# Altium schematic sheet VoltageLEDs.SchDoc
size A4; Organization: Altium Limited; Address1: L3, 12a Rodborough Rd; Address2: Frenchs Forest; Address3: NSW; Address4: Australia 2086
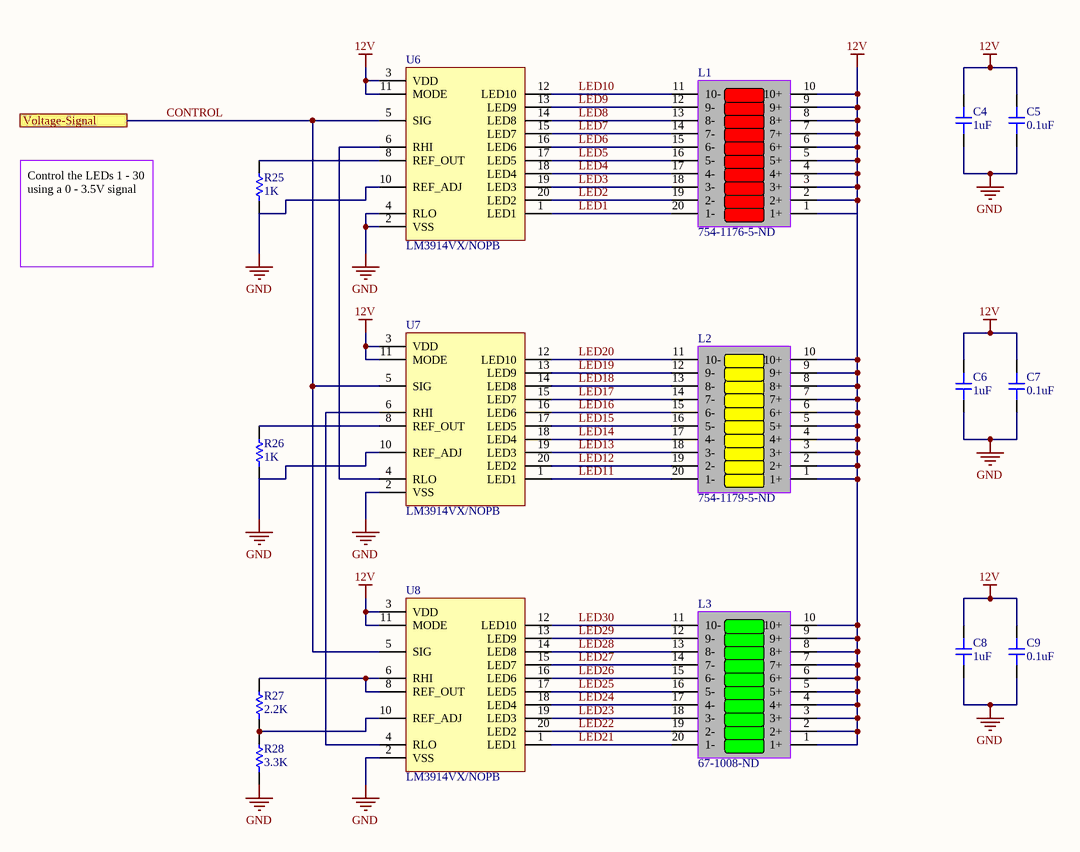
[diagram p0: VoltageLEDs.SchDoc]

## Parts
C4  1uF  [CAP-0805]
C5  0.1uF  [CAP-0805]
C6  1uF  [CAP-0805]
C7  0.1uF  [CAP-0805]
C8  1uF  [CAP-0805]
C9  0.1uF  [CAP-0805]
L1  754-1176-5-ND  [LEDBAR-10]
L2  754-1179-5-ND  [LEDBAR-10]
L3  67-1008-ND  [LEDBAR-10]
R25  1K  [RES-0603]
R26  1K  [RES-0603]
R27  2.2K  [RES-0603]
R28  3.3K  [RES-0603]
U6  LM3914VX/NOPB  [PLCC127P990X990X457-20N]
U7  LM3914VX/NOPB  [PLCC127P990X990X457-20N]
U8  LM3914VX/NOPB  [PLCC127P990X990X457-20N]

## Ports
Voltage-Signal

## Nets
12V: C4.2 C5.2 C6.2 C7.2 C8.2 C9.2 L1.1(1+) L1.2(2+) L1.3(3+) L1.4(4+) L1.5(5+) L1.6(6+) L1.7(7+) L1.8(8+) L1.9(9+) L1.10(10+) L2.1(1+) L2.2(2+) L2.3(3+) L2.4(4+) L2.5(5+) L2.6(6+) L2.7(7+) L2.8(8+) L2.9(9+) L2.10(10+) L3.1(1+) L3.2(2+) L3.3(3+) L3.4(4+) L3.5(5+) L3.6(6+) L3.7(7+) L3.8(8+) L3.9(9+) L3.10(10+) U6.3(VDD) U6.11(MODE) U7.3(VDD) U7.11(MODE) U8.3(VDD) U8.11(MODE)
GND: C4.1 C5.1 C6.1 C7.1 C8.1 C9.1 R25.1 R26.1 R28.1 U6.2(VSS) U6.4(RLO) U6.10(REF_ADJ) U7.2(VSS) U7.10(REF_ADJ) U8.2(VSS)
CONTROL: U6.5(SIG) U7.5(SIG) U8.5(SIG) ; port Voltage-Signal
LED1: L1.20(1-) U6.1(LED1)
LED2: L1.19(2-) U6.20(LED2)
LED3: L1.18(3-) U6.19(LED3)
LED4: L1.17(4-) U6.18(LED4)
LED5: L1.16(5-) U6.17(LED5)
LED6: L1.15(6-) U6.16(LED6)
LED7: L1.14(7-) U6.15(LED7)
LED8: L1.13(8-) U6.14(LED8)
LED9: L1.12(9-) U6.13(LED9)
LED10: L1.11(10-) U6.12(LED10)
LED11: L2.20(1-) U7.1(LED1)
LED12: L2.19(2-) U7.20(LED2)
LED13: L2.18(3-) U7.19(LED3)
LED14: L2.17(4-) U7.18(LED4)
LED15: L2.16(5-) U7.17(LED5)
LED16: L2.15(6-) U7.16(LED6)
LED17: L2.14(7-) U7.15(LED7)
LED18: L2.13(8-) U7.14(LED8)
LED19: L2.12(9-) U7.13(LED9)
LED20: L2.11(10-) U7.12(LED10)
LED21: L3.20(1-) U8.1(LED1)
LED22: L3.19(2-) U8.20(LED2)
LED23: L3.18(3-) U8.19(LED3)
LED24: L3.17(4-) U8.18(LED4)
LED25: L3.16(5-) U8.17(LED5)
LED26: L3.15(6-) U8.16(LED6)
LED27: L3.14(7-) U8.15(LED7)
LED28: L3.13(8-) U8.14(LED8)
LED29: L3.12(9-) U8.13(LED9)
LED30: L3.11(10-) U8.12(LED10)
NetR25_2: R25.2 U6.8(REF_OUT)
NetR26_2: R26.2 U7.8(REF_OUT)
NetR27_1: R27.1 R28.2 U8.10(REF_ADJ)
NetR27_2: R27.2 U8.6(RHI) U8.8(REF_OUT)
NetU6_6: U6.6(RHI) U7.4(RLO)
NetU7_6: U7.6(RHI) U8.4(RLO)

## Notes on the sheet
- Control the LEDs 1 - 30 using a 0 - 3.5V signal
- Title
- Size:
- Date:
- A4
- Number:
- Time:
- Revision:
- Sheet
- of
- File:

## Library data of the parts
C4 C6 C8 = C0805C105K5PACTU: CAP CER 1UF 50V X5R 0805; Manufacturer: KEMET; Dielectric Material: Ceramic; Tolerance: 10%; Supplier 1: Digi-Key; Manufacturer Part Number: C0805C105K5PACTU; Stock 1: 7193; Pricing 1: 1=0.33, 10=0.23, 100=0.1378, 500=0.10334, 1000=0.08726 (USD); Mount: Surface Mount; Case/Package: 0805; Weight: 0.000194oz; Case Code (Metric): 2012; Case Code (Imperial): 0805; Min Operating Temperature: -55°C; Max Operating Temperature: 85°C; Voltage Rating: 50V; Dielectric: X5R; Packaging: Tape and Reel; Termination: SMD/SMT; Voltage Rating (DC): 50V; Package Quantity: 2500; Capacitance: 1uF; Length: 0.079inch; Width: 0.049inch; Thickness: 0.055inch; REACH SVHC: No SVHC; Lead Free: Lead Free; ComponentLink1URL: https://api.kemet.com/component-edge/download/datasheet/C0805C105K5PAC7800.pdf?src-supplier=Digi-Key; ComponentLink1Description: https://api.kemet.com/component-edge/download/datasheet/C0805C105K5PAC7800.pdf?src-supplier=Digi-Key; ComponentLink2URL: http://www.farnell.com/datasheets/2746140.pdf?src-supplier=Farnell; ComponentLink2Description: http://www.farnell.com/datasheets/2746140.pdf?src-supplier=Farnell; ComponentLink3URL: http://www.mouser.com/ds/2/212/KEM_C1006_X5R_SMD-1103249.pdf?src-supplier=Mouser; ComponentLink3Description: http://www.mouser.com/ds/2/212/KEM_C1006_X5R_SMD-1103249.pdf?src-supplier=Mouser; ComponentLink4URL: http://www.farnell.com/datasheets/2746140.pdf?src-supplier=Newark; ComponentLink4Description: http://www.farnell.com/datasheets/2746140.pdf?src-supplier=Newark; ComponentLink5URL: http://www.farnell.com/datasheets/2032728.pdf?src-supplier=Element14; ComponentLink5Description: http://www.farnell.com/datasheets/2032728.pdf?src-supplier=Element14; Supplier Part Number 1: 399-15436-6-ND
C5 C7 C9 = C0805C104Z5VACTU: CAP CER 0.1UF 50V Y5V 0805; Manufacturer: KEMET; Dielectric Material: Ceramic; Capacitance: 100nF; Tolerance: 80%; Dissipation Factor: 5%; Supplier 1: Digi-Key; Manufacturer Part Number: C0805C104Z5VACTU; Stock 1: 929243; Pricing 1: 1=0.1, 10=0.057, 100=0.0254, 500=0.01818, 1000=0.01428 (USD); Mount: Surface Mount,PCB; Case/Package: 0805; Number of Pins: 2; Case Code (Metric): 2012; Case Code (Imperial): 0805; Min Operating Temperature: -30°C; Max Operating Temperature: 85°C; Package Quantity: 1; Voltage Rating: 50V; Packaging: Tape and Reel; Voltage Rating (DC): 50V; Dielectric: Y5V; Termination: SMD/SMT; Voltage: 50V; Length: 2mm; Height: 0.9mm; Lead Pitch: 0.75mm; Width: 0.049inch; Thickness: 0.039inch; Depth: 1.25mm; Radiation Hardening: No; REACH SVHC: No SVHC; Lead Free: Lead Free; ComponentLink1URL: http://www.alliedelec.com/m/d/9bfe7773041ffe9d406e68bc7b377fdd.pdf?src-supplier=Allied+Electronics; ComponentLink1Description: http://www.alliedelec.com/m/d/9bfe7773041ffe9d406e68bc7b377fdd.pdf?src-supplier=Allied+Electronics; ComponentLink2URL: https://www.verical.com/server-webapp/html/getDatasheet?partID=37101&src-supplier=Verical; ComponentLink2Description: https://www.verical.com/server-webapp/html/getDatasheet?partID=37101&src-supplier=Verical; ComponentLink3URL: https://www.verical.com/server-webapp/html/getDatasheet?partID=321176&src-supplier=Verical; ComponentLink3Description: https://www.verical.com/server-webapp/html/getDatasheet?partID=321176&src-supplier=Verical; ComponentLink4URL: http://www.farnell.com/datasheets/2123124.pdf?src-supplier=Element14; ComponentLink4Description: http://www.farnell.com/datasheets/2123124.pdf?src-supplier=Element14; Supplier Part Number 1: 399-1177-6-ND
L1 = 754-1176-5-ND: LED BAR GRAPH 10SEG 627NM RED; Manufacturer: Kingbright; Manufacturer Part Number: DC-10EWA; Lens Color: White; Lens Style: Diffused; Voltage Rating: 2V; Luminous Intensity: 9mcd; Wavelength: 625nm; Current: 30mA; Number of Segments: 10; Forward Current: 20mA; Lens Size: 1.78mm; Supplier 1: Digi-Key; Stock 1: 21; Pricing 1: 1=2.79, 10=2.474, 100=1.4364, 500=1.2768, 1000=1.09725, 2500=1.0374, 5000=1.01346, 10000=0.9975, 25000=0.97356 (USD); Mount: Through Hole; Color: Red; Min Operating Temperature: -40°C; Max Operating Temperature: 85°C; Forward Voltage: 2V; Illumination Color: Red; Package Quantity: 20; Operating Supply Voltage: 2V; Packaging: Rail/Tube; Number of LEDs: 10; Display Type: Bar Graph; Length: 25.4mm; Height: 10.16mm; Width: 25.4mm; REACH SVHC: No SVHC; Lead Free: Lead Free; ComponentLink1URL: https://www.distrelec.biz/Web/Downloads/12/75/tl661272-661275.pdf?mime=application%2Fpdf&src-supplier=Distrelec; ComponentLink1Description: https://www.distrelec.biz/Web/Downloads/12/75/tl661272-661275.pdf?mime=application%2Fpdf&src-supplier=Distrelec; ComponentLink2URL: http://www.mouser.com/ds/2/216/DC10EWA-8483.pdf?src-supplier=Mouser; ComponentLink2Description: http://www.mouser.com/ds/2/216/DC10EWA-8483.pdf?src-supplier=Mouser; ComponentLink3URL: http://www.kingbrightusa.com/images/catalog/SPEC/DC10EWA.pdf?src-supplier=Digi-Key; ComponentLink3Description: http://www.kingbrightusa.com/images/catalog/SPEC/DC10EWA.pdf?src-supplier=Digi-Key; ComponentLink4URL: http://uk.rs-online.com/webdocs/1385/0900766b81385017.pdf?src-supplier=RSComponents; ComponentLink4Description: http://uk.rs-online.com/webdocs/1385/0900766b81385017.pdf?src-supplier=RSComponents; ComponentLink5URL: http://www.rapidonline.com/pdf/55-0190e.pdf?src-supplier=Rapid+Electronics; ComponentLink5Description: http://www.rapidonline.com/pdf/55-0190e.pdf?src-supplier=Rapid+Electronics; ComponentLink6URL: http://www.farnell.com/datasheets/1683489.pdf?src-supplier=Element14; ComponentLink6Description: http://www.farnell.com/datasheets/1683489.pdf?src-supplier=Element14; ComponentLink7URL: http://www.produktinfo.conrad.com/datenblaetter/175000-199999/184837-da-01-en-RGB_ROT_LED_BAND.pdf?src-supplier=Conrad; ComponentLink7Description: http://www.produktinfo.conrad.com/datenblaetter/175000-199999/184837-da-01-en-RGB_ROT_LED_BAND.pdf?src-supplier=Conrad; ComponentLink8URL: http://www.produktinfo.conrad.com/datenblaetter/150000-174999/160137-da-01-en-BARGRAPH_ANZEIGE_TYP_DC_10EWA.pdf?src-supplier=Conrad; ComponentLink8Description: http://www.produktinfo.conrad.com/datenblaetter/150000-174999/160137-da-01-en-BARGRAPH_ANZEIGE_TYP_DC_10EWA.pdf?src-supplier=Conrad; Supplier Part Number 1: 754-1176-5-ND
L2 = LEDBAR-10-YLW: LED BAR GRAPH 10SEG 590NM YLW; Manufacturer: Kingbright; Manufacturer Part Number: DC-10YWA; Color: Yellow; Lens Color: White; Lens Style: Diffused,Round,Domed; Voltage Rating: 2.1V; Luminous Intensity: 9mcd; Wavelength: 588nm; Current: 30mA; Number of Segments: 10; Forward Current: 20mA; Lens Size: 3mm; Supplier 1: Digi-Key; Stock 1: 23; Pricing 1: 1=2.84, 10=2.517, 100=1.4616, 500=1.2992, 1000=1.1165, 2500=1.0556, 5000=1.03124, 10000=1.015, 25000=0.99064 (USD); Mount: Through Hole; Number of Pins: 20; Min Operating Temperature: -40°C; Max Operating Temperature: 85°C; Package Quantity: 20; Packaging: Rail/Tube; Forward Voltage: 2.1V; Illumination Color: Yellow; Operating Supply Voltage: 2.1V; Number of LEDs: 10; Display Type: Bar Graph; Height: 10.16mm; Width: 25.4mm; REACH SVHC: No SVHC; ComponentLink1URL: http://www.rapidonline.com/pdf/55-0190e.pdf?src-supplier=Rapid+Electronics; ComponentLink1Description: http://www.rapidonline.com/pdf/55-0190e.pdf?src-supplier=Rapid+Electronics; ComponentLink2URL: https://www.distrelec.biz/Web/Downloads/12/75/tl661272-661275.pdf?mime=application%2Fpdf&src-supplier=Distrelec; ComponentLink2Description: https://www.distrelec.biz/Web/Downloads/12/75/tl661272-661275.pdf?mime=application%2Fpdf&src-supplier=Distrelec; ComponentLink3URL: http://www.kingbrightusa.com/images/catalog/SPEC/DC10YWA.pdf?src-supplier=Digi-Key; ComponentLink3Description: http://www.kingbrightusa.com/images/catalog/SPEC/DC10YWA.pdf?src-supplier=Digi-Key; ComponentLink4URL: http://uk.rs-online.com/webdocs/0026/0900766b80026db8.pdf?src-supplier=RSComponents; ComponentLink4Description: http://uk.rs-online.com/webdocs/0026/0900766b80026db8.pdf?src-supplier=RSComponents; ComponentLink5URL: http://www.farnell.com/datasheets/1683491.pdf?src-supplier=Element14; ComponentLink5Description: http://www.farnell.com/datasheets/1683491.pdf?src-supplier=Element14; ComponentLink6URL: http://www.mouser.com/ds/2/216/DC10YWA-43302.pdf?src-supplier=Mouser; ComponentLink6Description: http://www.mouser.com/ds/2/216/DC10YWA-43302.pdf?src-supplier=Mouser; ComponentLink7URL: http://www.produktinfo.conrad.com/datenblaetter/150000-174999/160142-da-01-en-BARGRAPH_ANZEIGE_TYP_DC_10YWA.pdf?src-supplier=Conrad; ComponentLink7Description: http://www.produktinfo.conrad.com/datenblaetter/150000-174999/160142-da-01-en-BARGRAPH_ANZEIGE_TYP_DC_10YWA.pdf?src-supplier=Conrad; Supplier Part Number 1: 754-1179-5-ND
L3 = LEDBAR-10-GRN: LED ARRAY 10X25MM 10SEG GRN DIFF; Manufacturer: Lumex; Manufacturer Part Number: SSA-LXB10GW-GF/LP; Color: Green; Voltage Rating: 2.2V; Operating Supply Voltage: 2.6V; Number of Contacts: 18; Display Type: Bar Graph; Luminous Intensity: 8mcd; Forward Current: 20mA; Wavelength: 565nm; Power Consumption: 105mW; Viewing Angle: 160°; Lens Style: Diffused; Current: 25mA; Number of LEDs: 10; Supplier 1: Digi-Key; Stock 1: 6048; Pricing 1: 1=2.28, 10=2.018, 100=1.1718, 500=1.0416, 1000=0.89513, 2500=0.8463, 5000=0.82677, 10000=0.81375 (USD); Mount: Through Hole; Min Operating Temperature: -40°C; Max Operating Temperature: 85°C; Package Quantity: 20; Packaging: Bulk; Forward Voltage: 2.2V; Illumination Color: Green; Length: 25.1mm; Height: 6.8mm; Width: 10.1mm; REACH SVHC: No SVHC; Lead Free: Lead Free; ComponentLink1URL: http://www.lumex.com/content/files/ProductAttachment/SSA-LXB10GW-GF-LP.pdf?src-supplier=Digi-Key; ComponentLink1Description: http://www.lumex.com/content/files/ProductAttachment/SSA-LXB10GW-GF-LP.pdf?src-supplier=Digi-Key; ComponentLink2URL: http://www.farnell.com/datasheets/677482.pdf?src-supplier=Farnell; ComponentLink2Description: http://www.farnell.com/datasheets/677482.pdf?src-supplier=Farnell; ComponentLink3URL: http://www.farnell.com/datasheets/677482.pdf?src-supplier=Element14; ComponentLink3Description: http://www.farnell.com/datasheets/677482.pdf?src-supplier=Element14; ComponentLink4URL: http://www.farnell.com/datasheets/269031.pdf?src-supplier=Element14; ComponentLink4Description: http://www.farnell.com/datasheets/269031.pdf?src-supplier=Element14; ComponentLink5URL: http://www.mouser.com/ds/2/244/SSA-LXB10GW-GF%20LP-115645.pdf?src-supplier=Mouser; ComponentLink5Description: http://www.mouser.com/ds/2/244/SSA-LXB10GW-GF%20LP-115645.pdf?src-supplier=Mouser; Supplier Part Number 1: 67-1008-ND
R25 R26 = 0603-1KR: RES SMD 1K OHM 1% 1/10W 0603; Manufacturer: Vishay Dale; Manufacturer Part Number: CRCW06031K00FKEA; Resistance: 1kR; Power Rating: 100mW; Voltage Rating: 75V; Temperature Coefficient: 100ppm/°C; Supplier 1: Digi-Key; Stock 1: 671453; Pricing 1: 1=0.1, 10=0.034, 100=0.0139, 1000=0.00623, 2500=0.0054 (USD); Mount: Surface Mount; Case/Package: 0603; Number of Pins: 2; Weight: 7.1E-05oz; Case Code (Metric): 1608; Case Code (Imperial): 0603; Contact Plating: Tin; Min Operating Temperature: -55°C; Max Operating Temperature: 155°C; Composition: Thick Film; Tolerance: 1%; Packaging: Tape and Reel; Package Quantity: 10; Number of Terminations: 2; Termination: SMD/SMT; Military Standard: Not; Max Power Dissipation: 100mW; Voltage Rating (DC): 75V; Features: Automotive AEC-Q200; Length: 1.55mm; Height: 0.45mm; Width: 0.033inch; Depth: 0.85mm; Radiation Hardening: No; REACH SVHC: Unknown; Lead Free: Lead Free; ComponentLink1URL: http://www.vishay.com/docs/20035/dcrcwe3.pdf?src-supplier=Digi-Key; ComponentLink1Description: http://www.vishay.com/docs/20035/dcrcwe3.pdf?src-supplier=Digi-Key; ComponentLink2URL: http://uk.rs-online.com/webdocs/0d98/0900766b80d98afc.pdf?src-supplier=RSComponents; ComponentLink2Description: http://uk.rs-online.com/webdocs/0d98/0900766b80d98afc.pdf?src-supplier=RSComponents; ComponentLink3URL: http://www.vishay.com/docs/20035/dcrcwe3.pdf?src-supplier=Avnet; ComponentLink3Description: http://www.vishay.com/docs/20035/dcrcwe3.pdf?src-supplier=Avnet; ComponentLink4URL: http://www.vishay.com/docs/20035/dcrcwe3.pdf?src-supplier=Avnet+Asia; ComponentLink4Description: http://www.vishay.com/docs/20035/dcrcwe3.pdf?src-supplier=Avnet+Asia; ComponentLink5URL: http://www.farnell.com/datasheets/2310790.pdf?src-supplier=Element14; ComponentLink5Description: http://www.farnell.com/datasheets/2310790.pdf?src-supplier=Element14; ComponentLink6URL: https://www.distrelec.biz/Web/Downloads/a_/en/flD-CRCW-e3_data_en.pdf?mime=application%2Fpdf&src-supplier=Distrelec; ComponentLink6Description: https://www.distrelec.biz/Web/Downloads/a_/en/flD-CRCW-e3_data_en.pdf?mime=application%2Fpdf&src-supplier=Distrelec; ComponentLink7URL: http://www.vishay.com/docs/20035/dcrcwe3.pdf?src-supplier=Future+Electronics; ComponentLink7Description: http://www.vishay.com/docs/20035/dcrcwe3.pdf?src-supplier=Future+Electronics; ComponentLink8URL: http://www.vishay.com/docs/20035/dcrcwe3.pdf?src-supplier=Avnet+Europe; ComponentLink8Description: http://www.vishay.com/docs/20035/dcrcwe3.pdf?src-supplier=Avnet+Europe; Supplier Part Number 1: 541-1.00KHCT-ND
R27 = RC0603FR-072K2L: RES SMD 2.2K OHM 1% 1/10W 0603; Manufacturer: Yageo Phycomp; Power Rating: 100mW; Temperature Coefficient: 100ppm/°C; Resistance: 2.2kR; Voltage Rating (DC): 50V; Supplier 1: Digi-Key; Manufacturer Part Number: RC0603FR-072K2L; Stock 1: 8205077; Pricing 1: 1=0.1, 10=0.023, 100=0.0094, 1000=0.00421, 2500=0.00366 (USD); Mount: Surface Mount; Case/Package: 0603; Number of Pins: 2; Min Operating Temperature: -55°C; Max Operating Temperature: 155°C; Tolerance: 1%; Packaging: Cut Tape; Length: 1.6mm; Height: 0.45mm; Depth: 0.8mm; Width: 800um; REACH SVHC: No SVHC; Lead Free: Lead Free; Supplier Part Number 1: 311-2.20KHRDKR-ND
R28 = RC0603FR-073K3L: RES SMD 3.3K OHM 1% 1/10W 0603; Manufacturer: Yageo Phycomp; Power Rating: 100mW; Temperature Coefficient: 100ppm/°C; Voltage Rating (DC): 50V; Resistance: 3.3kR; Supplier 1: Digi-Key; Manufacturer Part Number: RC0603FR-073K3L; Stock 1: 3313966; Pricing 1: 1=0.1, 10=0.023, 100=0.0094, 1000=0.00421, 2500=0.00366 (USD); Mount: Surface Mount; Case/Package: 0603; Number of Pins: 2; Min Operating Temperature: -55°C; Max Operating Temperature: 155°C; Tolerance: 1%; Packaging: Cut Tape; Length: 1.6mm; Height: 0.45mm; Depth: 0.8mm; Width: 800um; REACH SVHC: No SVHC; Lead Free: Lead Free; Supplier Part Number 1: 311-3.30KHRDKR-ND
U6-U8 = LM3914VX/NOPB: IC DRVR DOT/BAR DISPLAY 20PLCC; Manufacturer: TI National Semiconductor; Max Supply Voltage: 25V; Max Power Dissipation: 1.365W; Output Current: 30mA; Number of Segments: 10; Nominal Supply Current: 9.2mA; Display Type: LCD; Supplier 1: Digi-Key; Manufacturer Part Number: LM3914VX/NOPB; Stock 1: 8115; Pricing 1: 1=4.32, 10=3.883, 25=3.6704, 100=3.1811, 250=3.01796, 500=2.70802 (USD); Mount: Surface Mount; Case/Package: PLCC; Number of Pins: 20; Min Operating Temperature: 0°C; Max Operating Temperature: 70°C; Packaging: Tape and Reel; Package Quantity: 1000; Series: LM3914; Max Supply Current: 9.2mA; Number of Outputs: 10; Power Dissipation: 1.365W; Number of Channels: 10; Supply Current: 9.2mA; Width: 8.89mm; Radiation Hardening: No; Lead Free: Lead Free; ComponentLink1URL: http://www.jameco.com/Jameco/Products/ProdDS/1282476.pdf?src-supplier=Jameco; ComponentLink1Description: http://www.jameco.com/Jameco/Products/ProdDS/1282476.pdf?src-supplier=Jameco; ComponentLink2URL: http://www.ti.com/general/docs/lit/getliterature.tsp?genericPartNumber=LM3914&&fileType=pdf&src-supplier=Avnet; ComponentLink2Description: http://www.ti.com/general/docs/lit/getliterature.tsp?genericPartNumber=LM3914&&fileType=pdf&src-supplier=Avnet; ComponentLink3URL: https://www.verical.com/server-webapp/html/getDatasheet?partID=632645&src-supplier=Verical; ComponentLink3Description: https://www.verical.com/server-webapp/html/getDatasheet?partID=632645&src-supplier=Verical; ComponentLink4URL: http://www.ti.com/lit/ds/symlink/lm3914.pdf?src-supplier=Digi-Key; ComponentLink4Description: http://www.ti.com/lit/ds/symlink/lm3914.pdf?src-supplier=Digi-Key; Supplier Part Number 1: LM3914VX/NOPBDKR-ND